# EAGLE schematic v2 (EAGLE 7.3.0)
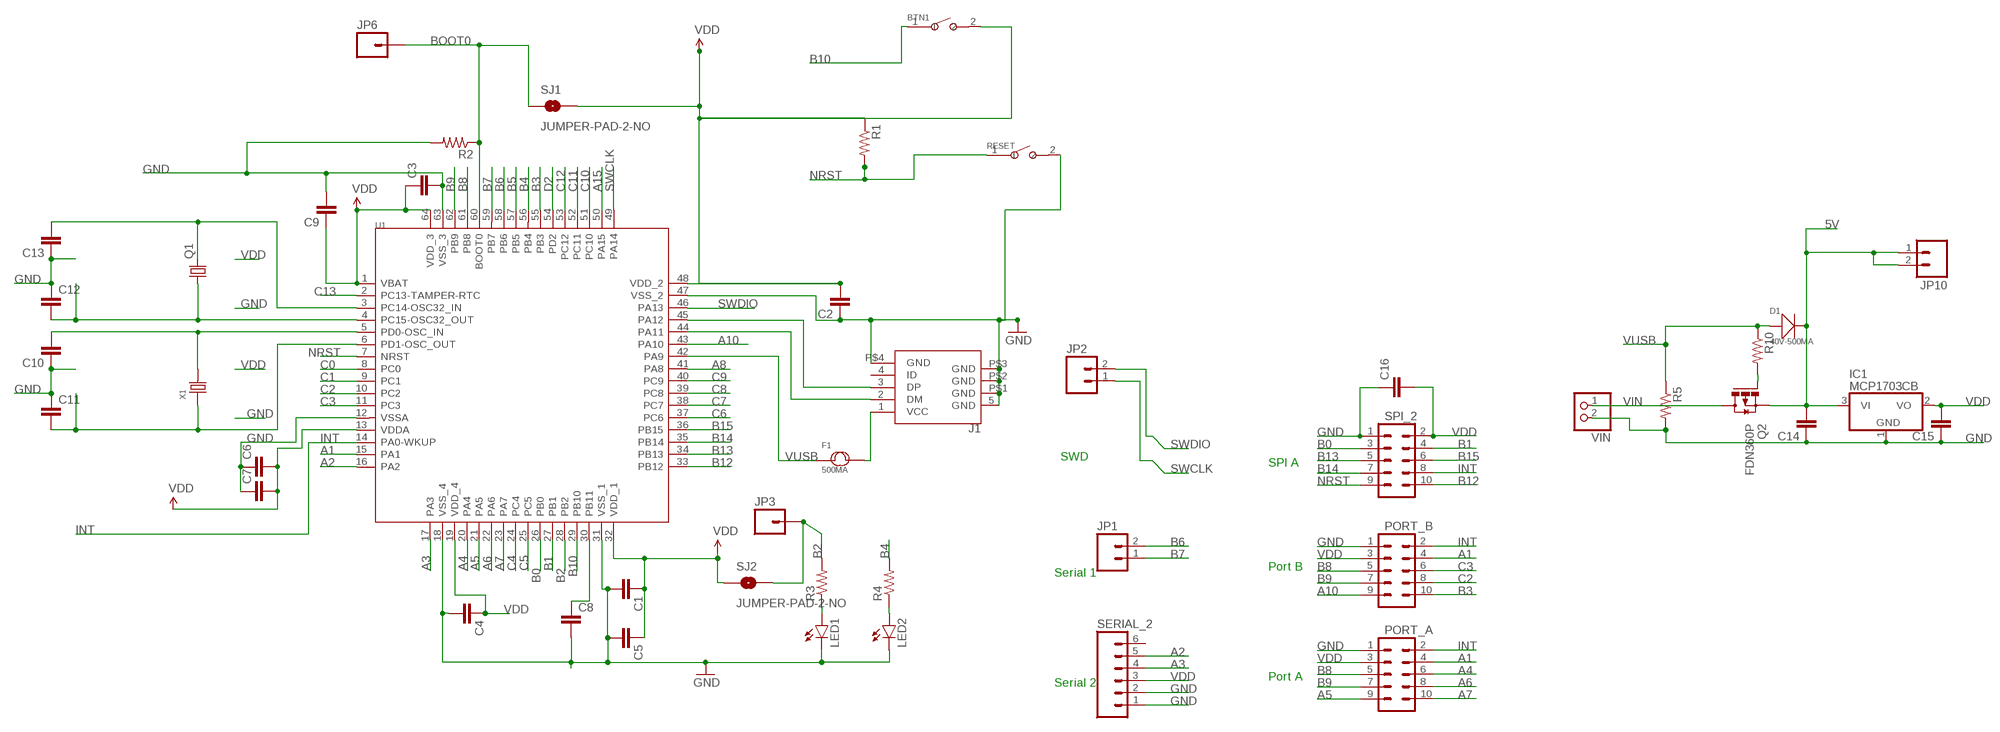
[diagram p0: schematic, sheet 1]

## Parts
BTN1  SMD-BUTTON(2P-6.0X3.0X2.5MM)-DHT-1163S  [SW2-4.0-6.0X3.0X2.5MM]
C1  CAP0805  [0805]
C2  CAP0805  [0805]
C3  CAP0805  [0805]
C4  CAP0805  [0805]
C5  CAP0805  [0805]
C6  CAP0805  [0805]
C7  CAP0805  [0805]
C8  CAP0805  [0805]
C9  CAP0805  [0805]
C10  CAP0805  [0805]
C11  CAP0805  [0805]
C12  CAP0805  [0805]
C13  CAP0805  [0805]
C14  CAP0805  [0805]
C15  CAP0805  [0805]
C16  CAP0805  [0805]
D1  40V-500MA  SMD-DIODE-SCHOTTKY-40V-500MA(SOD-123)  [SOD-123]
F1  500MA  SMD-PPTC-500MA(1206)  [F1206]
IC1  MCP1703CB  [SOT23]
J1  MINI-USB-RCPT-B-5PS-R/A-SMD(ST-USB-002A)  [MINIUSB5+4P-SMD-0.8-90D]
JP1  M02PTH  [1X02]
JP2  M02PTH  [1X02]
JP3  M01PTH  [1X01]
JP6  M01PTH  [1X01]
JP10  M02PTH  [1X02]
LED1  LED1206  [LED-1206]
LED2  LED1206  [LED-1206]
PORT_A  M05X2PTH  [AVR_ICSP]
PORT_B  M05X2PTH  [AVR_ICSP]
Q1  CRYSTALTC26H  [TC26H]
Q2  FDN360P  [SUPER-SOT3]
R1  RESISTOR0805-RES  [0805]
R2  RESISTOR0805-RES  [0805]
R3  RESISTOR0805-RES  [0805]
R4  RESISTOR0805-RES  [0805]
R5  RESISTOR0805-RES  [0805]
R10  RESISTOR0805-RES  [0805]
RESET  SMD-BUTTON(2P-6.0X3.0X2.5MM)-DHT-1163S  [SW2-4.0-6.0X3.0X2.5MM]
SERIAL_2  M06SILK_FEMALE_PTH  [1X06]
SJ1  JUMPER-PAD-2-NO  [PAD-JUMPER-2-NO_NO_SILK]
SJ2  JUMPER-PAD-2-NO  [PAD-JUMPER-2-NO_NO_SILK]
SPI_2  M05X2PTH  [AVR_ICSP]
U1  MCU-STM32F401RBT6(LQFP64)  [LQFP64-0.5-10X10MM]
VIN  JST_2PIN-SMT-RA  [JST-PH-2-SMT-RA]
X1  CRYSTAL'HC49US'  [HC49US]

## Nets
5V: C14.2 D1.- IC1.3(VI) JP10.1 JP10.2 Q2.2(S)
A1: PORT_A.4 PORT_B.4 U1.15(PA1)
A2: SERIAL_2.5 U1.16(PA2)
A3: SERIAL_2.4 U1.17(PA3)
A4: PORT_A.6 U1.20(PA4)
A5: PORT_A.9 U1.21(PA5)
A6: PORT_A.8 U1.22(PA6)
A7: PORT_A.10 U1.23(PA7)
A8: U1.41(PA8)
A10: PORT_B.9 U1.43(PA10)
A15: U1.50(PA15)
B0: SPI_2.3 U1.26(PB0)
B1: SPI_2.4 U1.27(PB1)
B2: JP3.1 R3.2 SJ2.2 U1.28(PB2)
B3: PORT_B.10 U1.55(PB3)
B4: R4.2 U1.56(PB4)
B5: U1.57(PB5)
B6: JP1.2 U1.58(PB6)
B7: JP1.1 U1.59(PB7)
B8: PORT_A.5 PORT_B.5 U1.61(PB8)
B9: PORT_A.7 PORT_B.7 U1.62(PB9)
B10: BTN1.1 U1.29(PB10)
B12: SPI_2.10 U1.33(PB12)
B13: SPI_2.5 U1.34(PB13)
B14: SPI_2.7 U1.35(PB14)
B15: SPI_2.6 U1.36(PB15)
BOOT0: JP6.1 R2.1 SJ1.1 U1.60(BOOT0)
C0: U1.8(PC0)
C1: U1.9(PC1)
C2: PORT_B.8 U1.10(PC2)
C3: PORT_B.6 U1.11(PC3)
C4: U1.24(PC4)
C5: U1.25(PC5)
C6: U1.37(PC6)
C7: U1.38(PC7)
C8: U1.39(PC8)
C9: U1.40(PC9)
C10: U1.51(PC10)
C11: U1.52(PC11)
C12: U1.53(PC12)
C13: U1.2(PC13-TAMPER-RTC)
D2: U1.54(PD2)
GND: C1.2 C2.1 C3.2 C4.2 C5.2 C6.1 C7.1 C8.2 C9.2 C10.1 C11.1 C12.1 C13.1 C14.1 C15.1 C16.1 IC1.1(GND) J1.5(GND) J1.P$1(GND) J1.P$2(GND) J1.P$3(GND) J1.P$4(GND) LED1.C LED2.C PORT_A.1 PORT_B.1 R2.2 R5.2 RESET.2 SERIAL_2.1 SERIAL_2.2 SPI_2.1 U1.12(VSSA) U1.18(VSS_4) U1.31(VSS_1) U1.47(VSS_2) U1.63(VSS_3) VIN.2
INT: PORT_A.2 PORT_B.2 SPI_2.8 U1.14(PA0-WKUP)
N$1: C13.2 Q1.2 U1.3(PC14-OSC32_IN)
N$2: C8.1 U1.30(PB11)
N$3: C12.2 Q1.1 U1.4(PC15-OSC32_OUT)
N$4: C10.2 U1.5(PD0-OSC_IN) X1.2
N$5: C11.2 U1.6(PD1-OSC_OUT) X1.1
N$6: J1.2(DM) U1.44(PA11)
N$7: J1.3(DP) U1.45(PA12)
N$8: F1.2 J1.1(VCC)
N$10: LED1.A R3.1
N$11: LED2.A R4.1
N$14: Q2.1(G) R10.2
NRST: R1.2 RESET.1 SPI_2.9 U1.7(NRST)
SWCLK: JP2.1 U1.49(PA14)
SWDIO: JP2.2 U1.46(PA13)
VDD: BTN1.2 C1.1 C2.2 C3.1 C4.1 C5.1 C6.2 C7.2 C9.1 C15.2 C16.2 IC1.2(VO) PORT_A.3 PORT_B.3 R1.1 SERIAL_2.3 SJ1.2 SJ2.1 SPI_2.2 U1.1(VBAT) U1.13(VDDA) U1.19(VDD_4) U1.32(VDD_1) U1.48(VDD_2) U1.64(VDD_3)
VIN: Q2.3(D) VIN.1
VUSB: D1.+ F1.1 R5.1 R10.1 U1.42(PA9)
Unconnected: J1.4(ID) SERIAL_2.6

## Notes on the sheet
- SWD
- SPI A
- Port B
- Serial 1
- Port A
- Serial 2

## Library data of the parts
BTN1 RESET = Seeed-OPL-Switch:SMD-BUTTON(2P-6.0X3.0X2.5MM): 311020029
C1-C16 = SparkFun-Passives:CAP: Capacitor Standard 0603 ceramic capacitor, and 0.1" leaded capacitor.
D1 = Seeed-OPL-Diode:SMD-DIODE-SCHOTTKY-40V-500MA(SOD-123): 304020012; MPN: B0540W
F1 = Seeed-OPL-fuse:SMD-PPTC-500MA(1206): 307010002
IC1 = linear:MCP1703: 250 mA, 16V, Low Quiescent Current LDO Regulator Source: http://ww1.microchip.com/downloads/en/DeviceDoc/22049b.pdf
J1 = Seeed-OPL-Connector:MINI-USB-RCPT-B-5PS-R/A-SMD(ST-USB-002A): 320010013; MPN: ST-USB-002A
JP1 JP2 JP10 = SparkFun-Connectors:M02: Standard 2-pin 0.1" header. Use with - straight break away headers ( PRT-00116) - right angle break away headers (PRT-00553) - swiss pins (PRT-00743) - machine pins (PRT-00117) - female headers (PRT-00115) Molex polarized connector foot print use with: PRT-08233 with associated crimp pins and housings. 2.54_SCREWTERM for use with PRT-10571. 3.5mm Screw Terminal footprints for PRT-08084 5mm Screw Terminal footprints for use with PRT-08432
JP3 JP6 = SparkFun-Connectors:M01: Header 1 Standard 1-pin 0.1" header. Use with straight break away headers (SKU : PRT-00116), right angle break away headers (PRT-00553), swiss pins (PRT-00743), machine pins (PRT-00117), and female headers (PRT-00115).
LED1 LED2 = SparkFun-LED:LED: LEDs Standard schematic elements and footprints for 5mm, 3mm, 1206, and 0603 sized LEDs. 5mm - Spark Fun Electronics SKU : COM-00529 (and others)
PORT_A PORT_B SPI_2 = SparkFun-Connectors:M05X2: Header 5x2 Standard 10-pin dual row 0.1" header. Commonly used with AVR-ISP. Use with Spark Fun Electronics SKU: PRT-00778
Q1 = adafruit:CRYSTAL: CRYSTAL; OC_FARNELL: unknown; OC_NEWARK: unknown
Q2 = transistor-power:FDN360P: Single P-Channel, PowerTrench (R) MOSFET Source: http://www.fairchildsemi.com/ds/FD/FDN360P.pdf
R1-R5 R10 = SparkFun-Passives:RESISTOR: Resistor Basic schematic elements and footprints for 0603, 1206, and PTH resistors.
SERIAL_2 = SparkFun-Connectors:M06: Header 6 Standard 6-pin 0.1" header. Use with straight break away headers (SKU : PRT-00116), right angle break away headers (PRT-00553), swiss pins (PRT-00743), machine pins (PRT-00117), and female headers (PRT-00115). Molex polarized connector foot print use with SKU : PRT-08094 with associated crimp pins and housings. NOTES ON THE VARIANTS LOCK and LOCK_LONGPADS... This footprint was designed to help hold the alignment of a through-hole component (i.e. 6-pin header) while soldering it into place. You may notice that each hole has been shifted either up or down by 0.005 of an inch from it's more standard position (which is a perfectly straight line). This slight alteration caused the pins (the squares in the middle) to touch the edges of the holes. Because they are alternating, it causes a "brace" to hold the component in place. 0.005 has proven to be the perfect amount of "off-center" position when using our standard breakaway headers. Although looks a little odd when you look at the bare footprint, once you have a header in there, the alteration is very hard to notice. Also,if you push a header all the way into place, it is covered up entirely on the bottom side. This idea of altering the position of holes to aid alignment will be further integrated into the Sparkfun Library for other footprints. It can help hold any component with 3 or more connection pins.; PROD_ID: CONN-08437
SJ1 SJ2 = SparkFun-Passives:JUMPER-PAD-2-NO
U1 = Seeed-OPL-ic:MCU-STM32F401RBT6(LQFP64): 310010113; MPN: STM32F401RBT6
VIN = adafruit:JST_2PIN: JST 2-Pin Connectors of various flavors SMT-RA (S2B-PH-SM4) 4UConnector #17311 SMT (B2B-PH-SM4) THM-RA (S2B-PH) THM (B2B-PH)
X1 = Seeed-OPL-crystal-osctllator:CRYSTAL